# EAGLE design rapidshark-motor-filter-mk-1.0 (EAGLE 7.5.0)
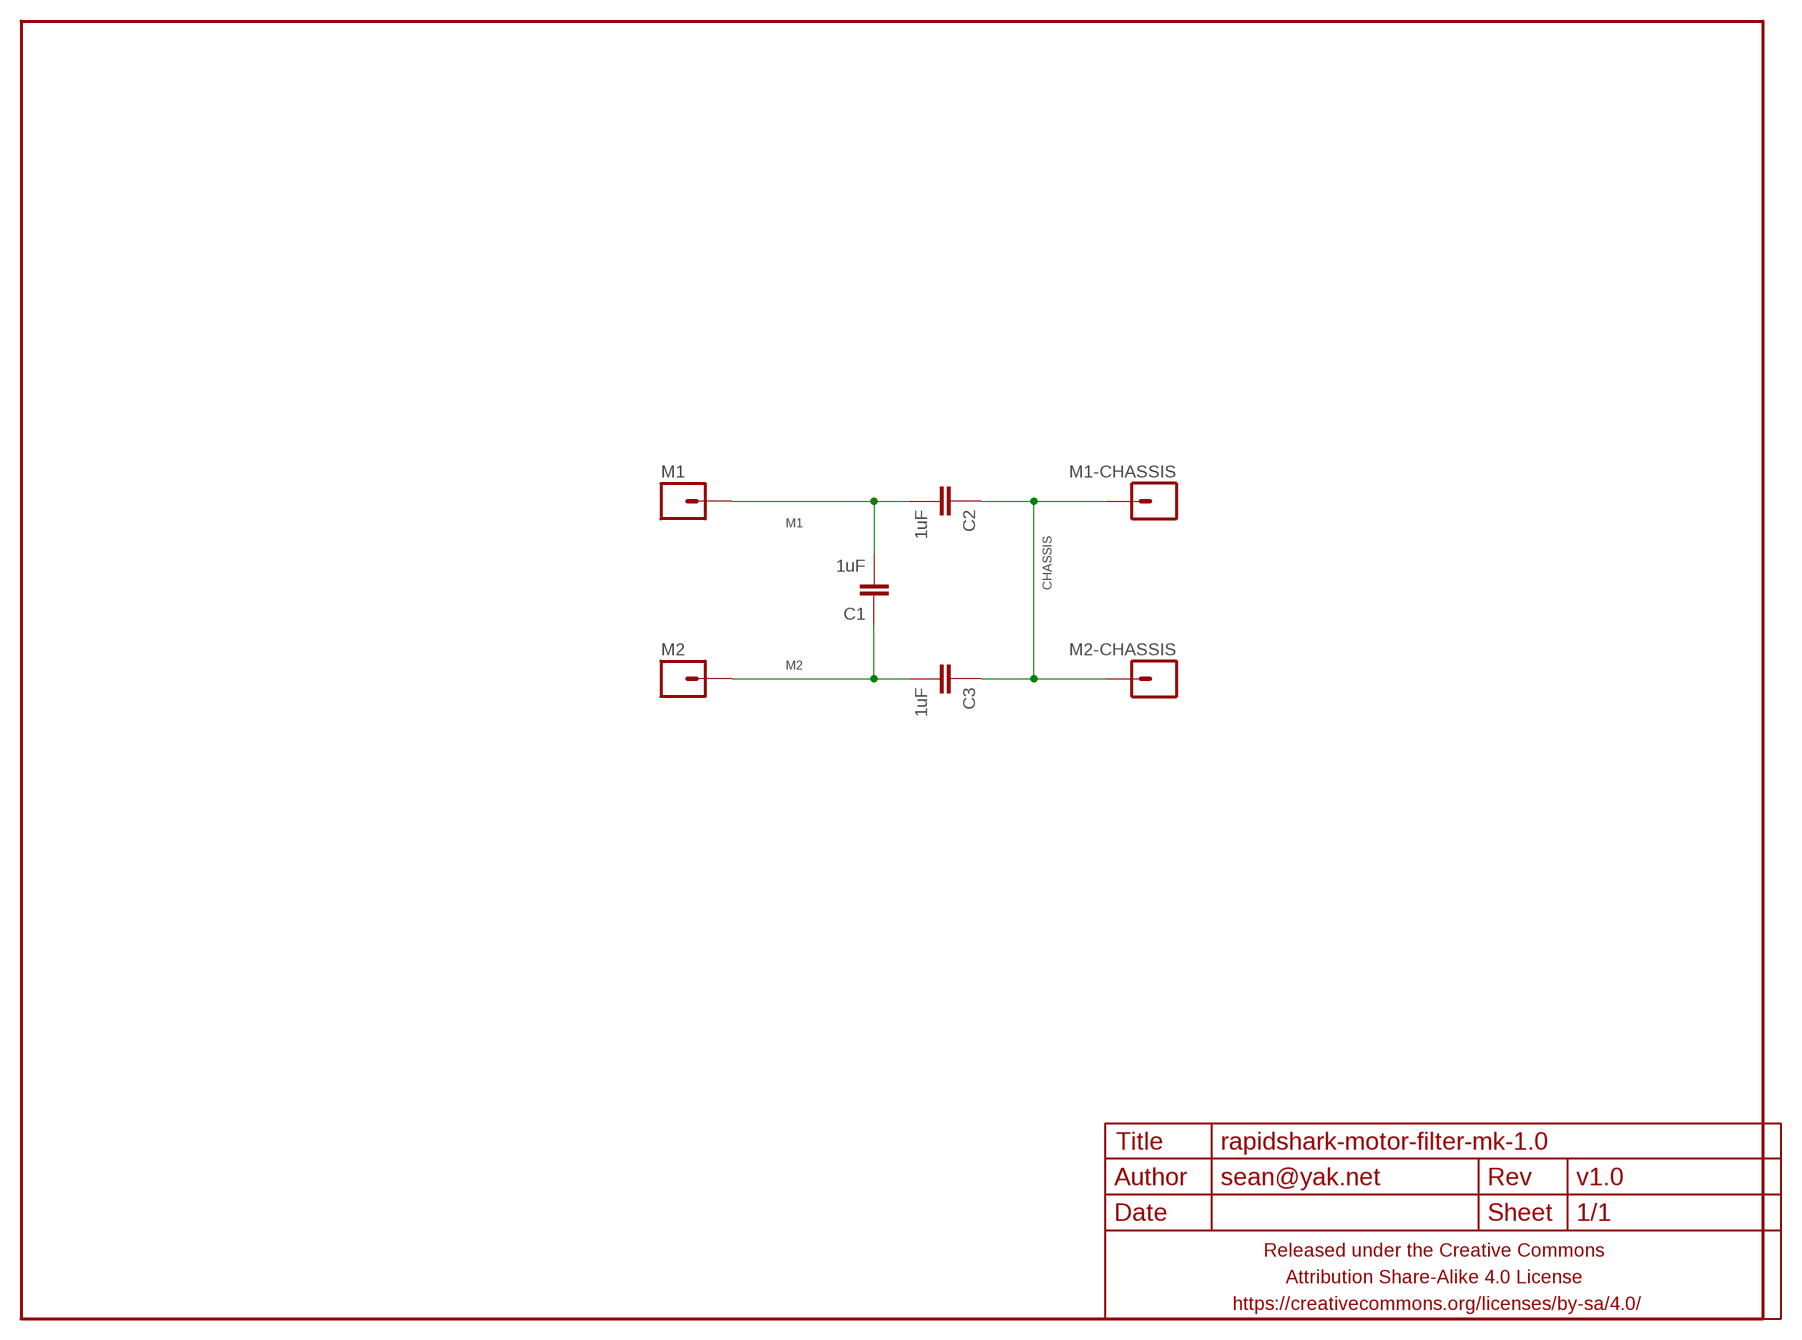
[diagram p0: schematic, sheet 1]

## Parts
C1  1uF  CAPACITOR-CERAMICC0805-TIGHTER  [C0805-TIGHTER]
C2  1uF  CAPACITOR-CERAMICC0805-TIGHTER  [C0805-TIGHTER]
C3  1uF  CAPACITOR-CERAMICC0805-TIGHTER  [C0805-TIGHTER]
FRAME1  FRAME-LETTERNO_PACKAGE  [DUMMY]
M1  M01PTH-2.5MM  [1X01-2.5MM]
M1-CHASSIS  M01SMDNS  [1X01NS]
M2  M01PTH-2.5MM  [1X01-2.5MM]
M2-CHASSIS  M01SMDNS  [1X01NS]

## Nets
CHASSIS: C2.1 C3.1 M1-CHASSIS.1 M2-CHASSIS.1
M1: C1.2 C2.2 M1.1
M2: C1.1 C3.2 M2.1

## Library data of the parts
C1-C3 = a_parts:CAPACITOR-CERAMIC: CAPACITOR, European symbol
FRAME1 = A_butts:FRAME-LETTER: Schematic Frame Standard 8.5x11 US Letter frame; DESIGNER: sean@yak.net; VERSION: v1.0
M1 M1-CHASSIS M2 M2-CHASSIS = a_parts:M01: Header 1 Standard 1-pin 0.1" header. Use with straight break away headers (SKU : PRT-00116), right angle break away headers (PRT-00553), swiss pins (PRT-00743), machine pins (PRT-00117), and female headers (PRT-00115).

## Board
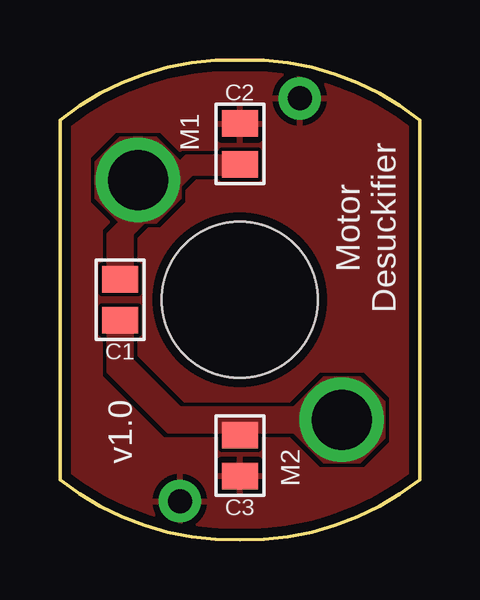
[diagram p1: board, top side]
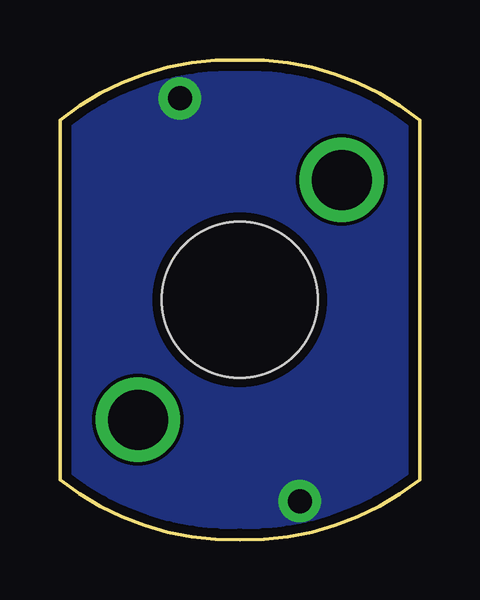
[diagram p2: board, bottom side, seen from below]

Size 15 x 20 mm. Coordinates in mm from the lower left corner, seen from the top.
Outline: 15,17.5 15,2.5 arc-40 7.5,0 arc-40 0,2.5 0,17.5 arc-40 7.5,20 arc-40 15,17.5
Copper layers (1*16): Top 0.0356mm / dielectric 1.5011mm / Bottom 0.0356mm
Design rules "LaenPCBOrder_2": minimum track width 6mil, minimum drill 13mil, track to track 6mil, track to pad 6mil, pad to pad 6mil, via to via 6mil, smd to smd 6mil, copper to edge 15mil, drill to drill 6mil, minimum pad ring 7mil, minimum via ring 7mil, stop-mask expansion 3mil, vias tented up to drill 20mil, thermal gap 10mil
Holes 6.5 mm at 7.5,10

### Footprints (pad centres in the part's own frame; a part is rotated, then mirrored left to right if it is on the bottom)
C0805-TIGHTER = smd 1.1 x 1.5: 1 -0.85,0; 2 0.85,0
1X01-2.5MM = drill 2.5 pad 3.5: 1 0,0
1X01NS = drill 1 pad 1.778: 1 0,0

### Placement (x,y rotation side)
C1  2.5,10 90 top
C2  7.5,16.5 270 top
C3  7.5,3.5 90 top
FRAME1  0,0 0 bottom
M1  3.25,15 270 top
M1-CHASSIS  10,18.4 270 top
M2  11.75,5 90 top
M2-CHASSIS  5,1.6 270 top

### Tracks (layer width: path | path; a pad name or v marks a point on that pad's centre or on a via)
CHASSIS
  pour Bottom (rank 6, no thermals): 0,2.5 0,17.5 arc-40 7,20 arc-40 15,17.5 15,2.5 arc-40 7.5,0 arc-40
  pour Top (rank 6): 0,2.5 0,17.5 arc-40 7,20 arc-40 15,17.5 15,2.5 arc-40 7.5,0 arc-40
M1
  pour Top (rank 5, no thermals): 2,10.5 3,10.5 3,12.75 3.5,13.25 4,13.25 5,14.25 5,14.75 5.5,15.25 7.5,15.25 7.5,16 5.25,16 5,15.75 4,16.75 2.5,16.75 1.5,15.75 1.5,14.25 2.5,13.25 2,12.75
M2
  pour Top (rank 5, no thermals): 11,6.75 12.5,6.75 13.5,5.75 13.5,4.25 12.5,3.25 11,3.25 9.75,4.5 8,4.5 8,4 7,4 7,4.5 4.5,4.5 2,7 2,9.5 3,9.5 3,7.5 5,5.5 9.75,5.5

### Text on the board
tPlace: Motor / Desuckifier